# EAGLE design probe v2 (EAGLE 6.4)
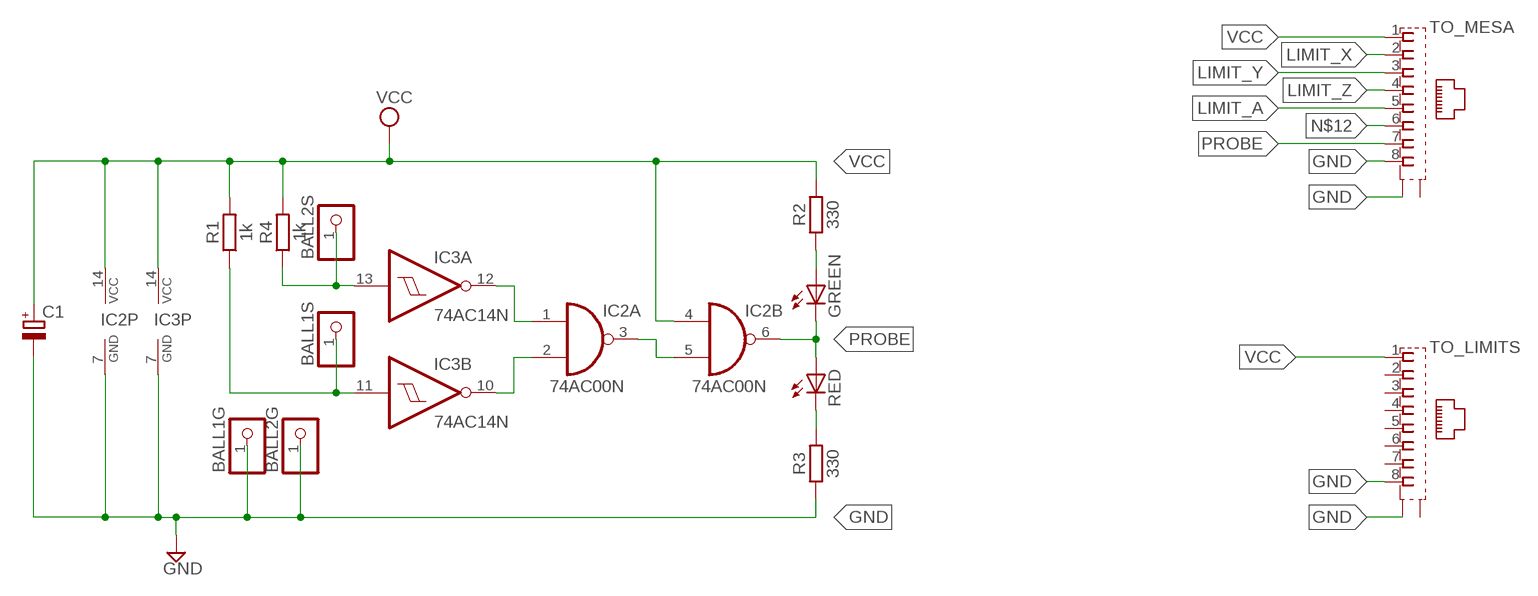
[diagram p0: schematic, sheet 1]

## Parts
BALL1G  PINHD-1X1  [1X01]
BALL1S  PINHD-1X1  [1X01]
BALL2G  PINHD-1X1  [1X01]
BALL2S  PINHD-1X1  [1X01]
C1  CPOL-EUE5-10.5  [E5-10,5]
GREEN  LED5MM  [LED5MM]
IC2  74AC00N  [DIL14]
IC3  74AC14N  [DIL14]
R1  1k  R-EU_0207/10  [0207/10]
R2  330  R-EU_0207/10  [0207/10]
R3  330  R-EU_0207/10  [0207/10]
R4  1k  R-EU_0207/10  [0207/10]
RED  LED5MM  [LED5MM]
TO_LIMITS  558310-1  [558310-1]
TO_MESA  558310-1  [558310-1]

## Nets
BALL: BALL1S.1 IC3.11(B:I) R1.1
GND: BALL1G.1 BALL2G.1 C1.- IC2.7(P:GND) IC3.7(P:GND) R3.1 TO_LIMITS.8 TO_LIMITS.G2(S1) TO_MESA.8 TO_MESA.G2(S1)
LIMIT_A: TO_MESA.5
LIMIT_X: TO_MESA.2
LIMIT_Y: TO_MESA.3
LIMIT_Z: TO_MESA.4
N$1: GREEN.A R2.1
N$2: R3.2 RED.K(C)
N$4: IC2.1(A:I0) IC3.12(A:O)
N$5: IC2.2(A:I1) IC3.10(B:O)
N$6: BALL2S.1 IC3.13(A:I) R4.1
N$7: IC2.3(A:O) IC2.5(B:I1)
N$12: TO_MESA.6
PROBE: GREEN.K(C) IC2.6(B:O) RED.A TO_MESA.7
VCC: C1.+ IC2.4(B:I0) IC2.14(P:VCC) IC3.14(P:VCC) R1.2 R2.2 R4.2 TO_LIMITS.1 TO_MESA.1
Unconnected: IC2.8(C:O) IC2.9(C:I0) IC2.10(C:I1) IC2.11(D:O) IC2.12(D:I0) IC2.13(D:I1) IC3.1(D:I) IC3.2(D:O) IC3.3(E:I) IC3.4(E:O) IC3.5(F:I) IC3.6(F:O) IC3.8(C:O) IC3.9(C:I) TO_LIMITS.2 TO_LIMITS.3 TO_LIMITS.4 TO_LIMITS.5 TO_LIMITS.6 TO_LIMITS.7 TO_LIMITS.G1(S2) TO_MESA.G1(S2)

## Library data of the parts
BALL1G BALL1S BALL2G BALL2S = pinhead:PINHD-1X1: PIN HEADER
C1 = rcl:CPOL-EU: POLARIZED CAPACITOR, European symbol
GREEN RED = led:LED: LED OSRAM: - CHIPLED LG R971, LG N971, LY N971, LG Q971, LY Q971, LO R971, LY R971 LH N974, LH R974 LS Q976, LO Q976, LY Q976 LO Q996 - Hyper CHIPLED LW Q18S LB Q993, LB Q99A, LB R99A - SideLED LS A670, LO A670, LY A670, LG A670, LP A670 LB A673, LV A673, LT A673, LW A673 LH A674 LY A675 LS A676, LA A676, LO A676, LY A676, LW A676 LS A679, LY A679, LG A679 - Hyper Micro SIDELED® LS Y876, LA Y876, LO Y876, LY Y876 LT Y87S - SmartLED LW L88C, LW L88S LB L89C, LB L89S, LG L890 LS L89K, LO L89K, LY L89K LS L896, LA L896, LO L896, LY L896 - TOPLED LS T670, LO T670, LY T670, LG T670, LP T670 LSG T670, LSP T670, LSY T670, LOP T670, LYG T670 LG T671, LOG T671, LSG T671 LB T673, LV T673, LT T673, LW T673 LH T674 LS T676, LA T676, LO T676, LY T676, LB T676, LH T676, LSB T676, LW T676 LB T67C, LV T67C, LT T67C, LS T67K, LO T67K, LY T67K, LW E67C LS E67B, LA E67B, LO E67B, LY E67B, LB E67C, LV E67C, LT E67C LW T67C LS T679, LY T679, LG T679 LS T770, LO T770, LY T770, LG T770, LP T770 LB T773, LV T773, LT T773, LW T773 LH T774 LS E675, LA E675, LY E675, LS T675 LS T776, LA T776, LO T776, LY T776, LB T776 LHGB T686 LT T68C, LB T68C - Hyper Mini TOPLED® LB M676 - Mini TOPLED Santana® LG M470 LS M47K, LO M47K, LY M47K Source: http://www.osram.convergy.de LUXEON: - LUMILED® LXK2-PW12-R00, LXK2-PW12-S00, LXK2-PW14-U00, LXK2-PW14-V00 LXK2-PM12-R00, LXK2-PM12-S00, LXK2-PM14-U00 LXK2-PE12-Q00, LXK2-PE12-R00, LXK2-PE12-S00, LXK2-PE14-T00, LXK2-PE14-U00 LXK2-PB12-K00, LXK2-PB12-L00, LXK2-PB12-M00, LXK2-PB14-N00, LXK2-PB14-P00, LXK2-PB14-Q00 LXK2-PR12-L00, LXK2-PR12-M00, LXK2-PR14-Q00, LXK2-PR14-R00 LXK2-PD12-Q00, LXK2-PD12-R00, LXK2-PD12-S00 LXK2-PH12-R00, LXK2-PH12-S00 LXK2-PL12-P00, LXK2-PL12-Q00, LXK2-PL12-R00 Source: www.luxeon.com KINGBRIGHT: KA-3528ASYC Source: www.kingbright.com
IC2 = 74xx-eu:74*00: Quad 2-input NAND gate
IC3 = 74xx-eu:74*14: Hex schmitt trigger INVERTER
R1-R4 = rcl:R-EU_: RESISTOR, European symbol
TO_LIMITS TO_MESA = con-amp:558310-1: AMP connector

## Net classes
0 default: width 0.5 mm, drill 0.5 mm, clearance 0.355 mm

## Board
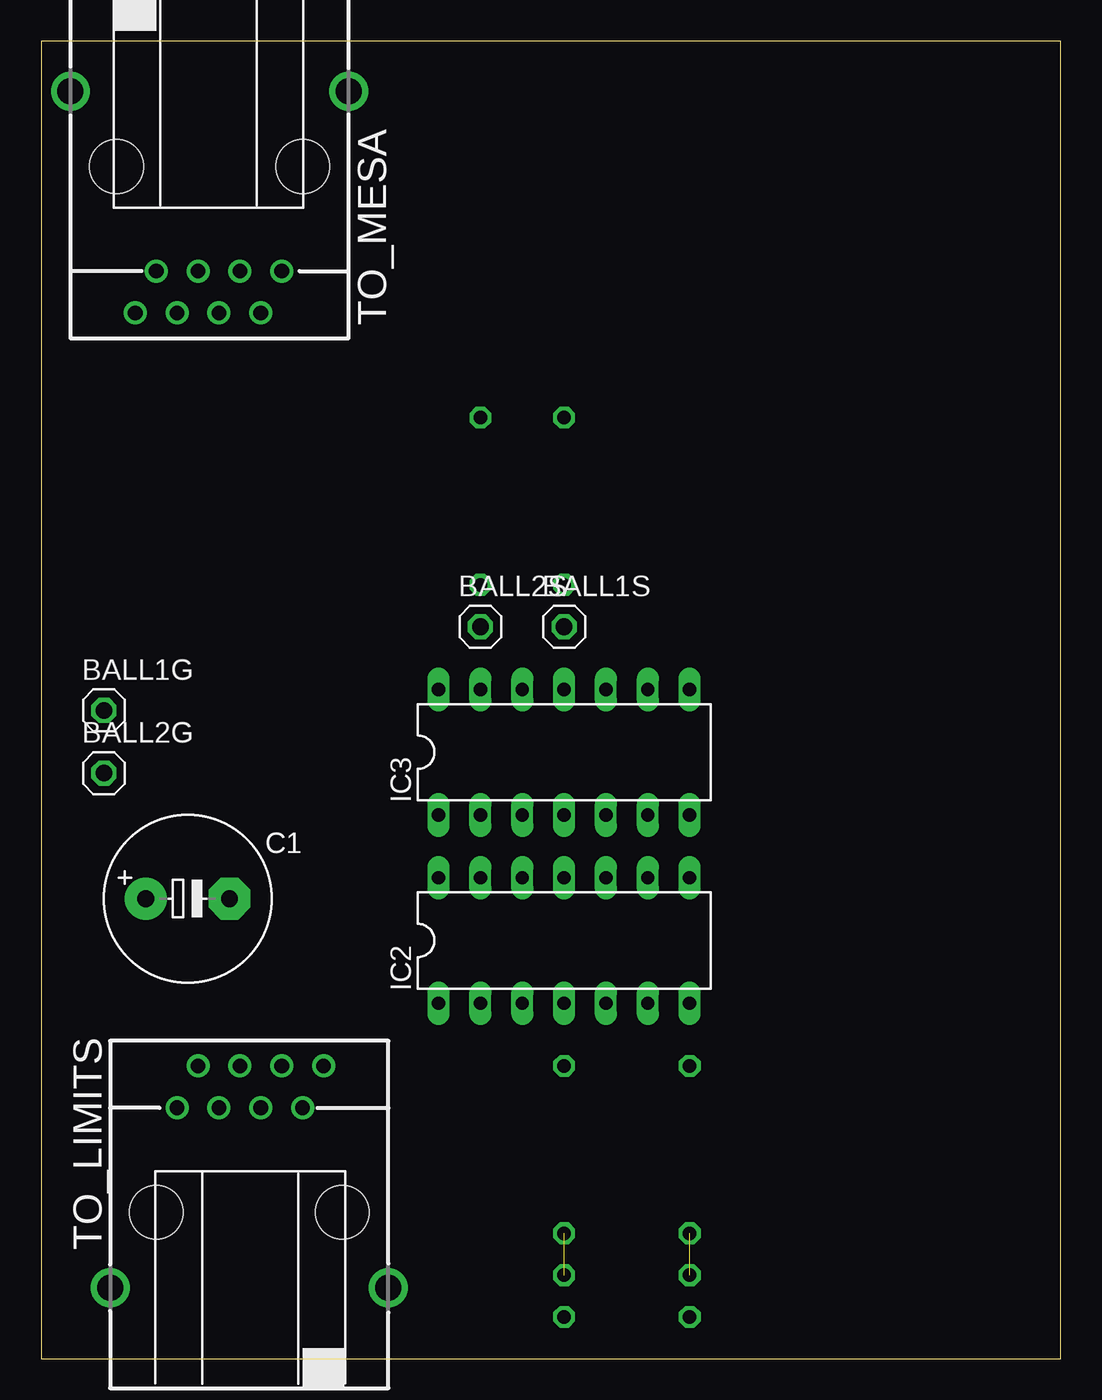
[diagram p1: board, top side]
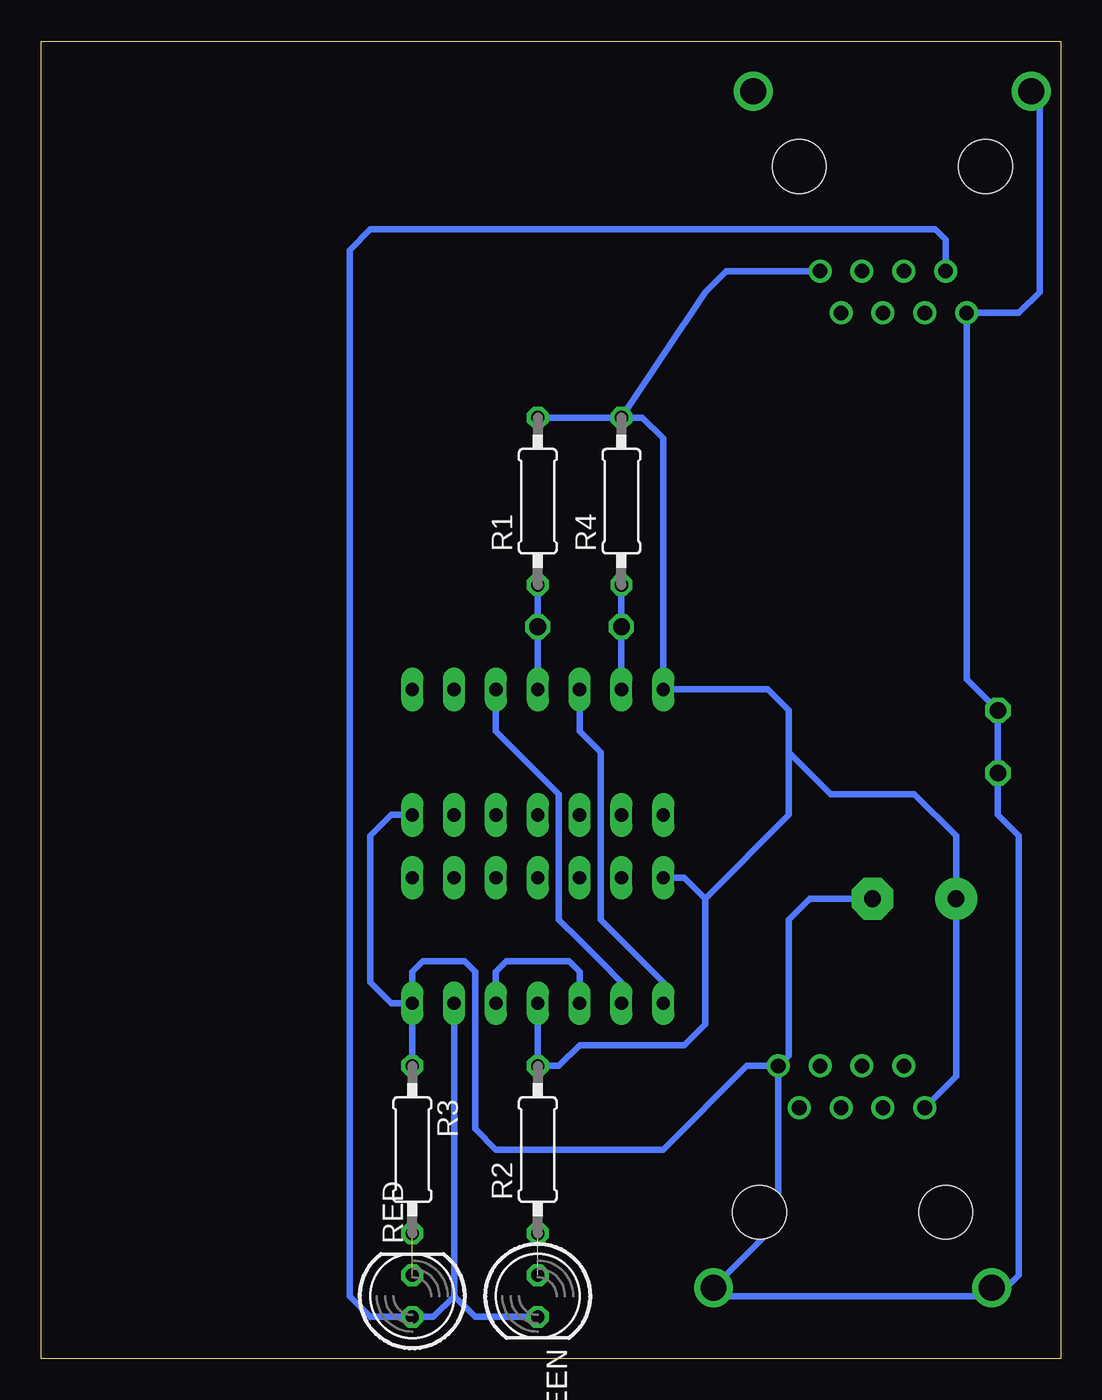
[diagram p2: board, bottom side, seen from below]

Size 61.9 x 80 mm. Coordinates in mm from the lower left corner, seen from the top.
Outline: 0,0 61.9,0 61.9,80 0,80 0,0
Copper layers (1*16): Top 0.035mm / dielectric 1.5mm / Bottom 0.035mm
Design rules "default": minimum track width 10mil, minimum drill 24mil, track to track 8mil, track to pad 8mil, pad to pad 8mil, via to via 8mil, smd to smd 8mil, copper to edge 40mil, drill to drill 8mil, minimum pad ring 10mil, minimum via ring 8mil, stop-mask expansion 4mil, vias tented up to drill 0mil, thermal gap 10mil

### Footprints (pad centres in the part's own frame; a part is rotated, then mirrored left to right if it is on the bottom)
1X01 = drill 1.016 octagon: 1 0,0
E5-10,5 = drill 1.016 pad 2.54: + -2.54,0 | drill 1.016 pad 2.54 octagon: - 2.54,0
LED5MM = drill 0.813 octagon: A -1.27,0; K 1.27,0
DIL14 = drill 0.813 long: 1 -7.62,-3.81; 2 -5.08,-3.81; 3 -2.54,-3.81; 4 0,-3.81; 5 2.54,-3.81; 6 5.08,-3.81; 7 7.62,-3.81; 8 7.62,3.81; 9 5.08,3.81; 10 2.54,3.81; 11 0,3.81; 12 -2.54,3.81; 13 -5.08,3.81; 14 -7.62,3.81
0207/10 = drill 0.813 octagon: 1 -5.08,0; 2 5.08,0
558310-1 = drill 0.889: 1 -4.445,6.35; 2 -3.175,8.89; 3 -1.905,6.35; 4 -0.635,8.89; 5 0.635,6.35; 6 1.905,8.89; 7 3.175,6.35; 8 4.445,8.89 | drill 1.575 pad 2.184: G1 -8.509,-4.572; G2 8.382,-4.572 | hole 3.251: -5.715,0; 5.588,0

### Placement (x,y rotation side)
BALL1G  3.81,39.37 0 top
BALL1S  31.75,44.45 0 top
BALL2G  3.81,35.56 0 top
BALL2S  26.67,44.45 0 top
C1  8.89,27.94 0 top
GREEN  31.75,3.81 270 bottom
IC2  31.75,25.4 0 top
IC3  31.75,36.83 0 top
R1  31.75,52.07 90 bottom
R2  31.75,12.7 90 bottom
R3  39.37,12.7 270 bottom
R4  26.67,52.07 90 bottom
RED  39.37,3.81 90 bottom
TO_LIMITS  12.7,8.89 0 top
TO_MESA  10.16,72.39 180 top

### Tracks (layer width: path | path; a pad name or v marks a point on that pad's centre or on a via)
BALL
  Bottom 0.406: IC3.11 BALL1S.1 R1.1
GND
  Bottom 0.406: C1.- 15.24,27.94 16.51,26.67 16.51,18.41 TO_LIMITS.8 | TO_MESA.G2 1.27,76.45 1.27,64.77 2.54,63.5 TO_MESA.8 5.71,41.27 BALL1G.1 BALL2G.1 3.81,33.02 2.54,31.75 2.54,5.08 3.81,3.81 20.57,3.81 TO_LIMITS.G2 17.14,8.26 TO_LIMITS.8 | R3.1 IC2.7 | IC2.7 40.64,21.59 41.91,22.86 41.91,31.75 40.64,33.02 IC3.7 | TO_LIMITS.8 19.05,17.78 24.13,12.7 34.29,12.7 35.56,13.97 35.56,23.5 36.2,24.13 38.73,24.13 39.37,23.5 IC2.7
N$1  (1 unrouted)
N$2  (1 unrouted)
N$4
  Bottom 0.406: IC3.12 29.21,38.1 27.94,36.83 27.94,26.67 26.67,25.4 25.4,24.13 24.13,22.86 IC2.1
N$5
  Bottom 0.406: IC3.10 34.29,38.1 33.02,36.83 31.75,35.56 30.48,34.29 30.48,26.67 29.21,25.4 27.94,24.13 26.67,22.86 IC2.2
N$6
  Bottom 0.406: IC3.13 BALL2S.1 R4.1
N$7
  Bottom 0.406: IC2.3 29.21,23.5 29.84,24.13 33.66,24.13 34.29,23.5 IC2.5
PROBE
  Bottom 0.406: TO_MESA.7 6.99,67.94 7.62,68.58 41.91,68.58 43.18,67.31 43.18,31.75 43.18,3.81 41.91,2.54 RED.A 38.1,2.54 36.83,3.81 | IC2.6 36.83,3.81 | GREEN.K 35.56,2.54 36.83,3.81
VCC
  Bottom 0.406: R4.2 R1.2 | R4.2 25.4,57.15 24.13,55.88 IC3.14 17.78,40.64 16.51,39.37 16.51,36.83 | TO_LIMITS.1 6.35,17.14 C1.+ 6.35,31.75 8.89,34.29 13.97,34.29 16.51,36.83 | TO_MESA.1 20.32,66.04 21.59,64.77 R4.2 | R2.2 IC2.4 R2.2 | R2.2 30.48,17.78 29.21,19.05 22.86,19.05 21.59,20.32 21.59,27.94 | 21.59,27.94 22.86,29.21 IC2.14 | 16.51,36.83 16.51,33.02 21.59,27.94